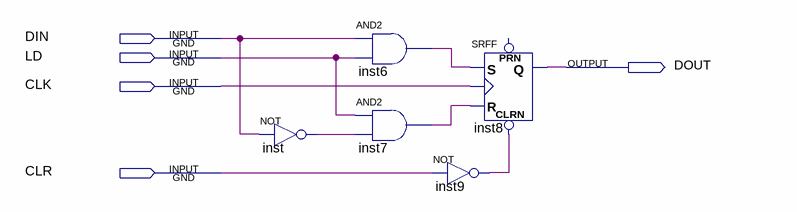
[diagram p0: schematic sheet]
// Quartus schematic reg1_ld_clr.bdf as structural Verilog: 5 symbols, 5 pins
module reg1_ld_clr (
  input  DIN,
  input  LD,
  input  CLK,
  input  CLR,
  output DOUT
);

  wire inst6_out, inst7_out, inst9_out, inst_out;

  not inst (inst_out, DIN);
  and inst6 (inst6_out, DIN, LD);
  and inst7 (inst7_out, LD, inst_out);
  not inst9 (inst9_out, CLR);
  SRFF inst8 (.CLRN(inst9_out), .S(inst6_out), .R(inst7_out), .CLK(CLK), .Q(DOUT));  // open: PRN
endmodule
